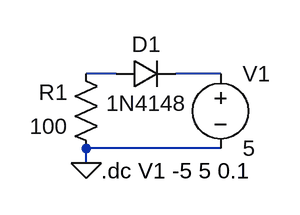
[diagram p0: schematic diode.asc]
diode.asc, the LTspice schematic file:
Version 4.1
SHEET 1 880 680
WIRE 176 128 144 128
WIRE 288 128 240 128
WIRE 288 208 144 208
WIRE 144 224 144 208
FLAG 144 224 0
SYMBOL diode 176 144 R270
WINDOW 0 32 32 VTop 2
WINDOW 3 0 32 VBottom 2
SYMATTR InstName D1
SYMATTR Value 1N4148
SYMBOL voltage 288 112 R0
WINDOW 123 0 0 Left 0
WINDOW 39 0 0 Left 0
SYMATTR InstName V1
SYMATTR Value 5
SYMBOL res 160 224 R180
WINDOW 0 36 76 Left 2
WINDOW 3 36 40 Left 2
SYMATTR InstName R1
SYMATTR Value 100
TEXT 160 232 Left 2 !.dc V1 -5 5 0.1

The netlist it stands for:
* diode.asc
D1 N001 N002 1N4148
V1 N002 0 5
R1 0 N001 100
.model D D
.lib standard.dio
.dc V1 -5 5 0.1
.backanno
.end